# EAGLE design 608_donkey_030200 (EAGLE 9.6.2)
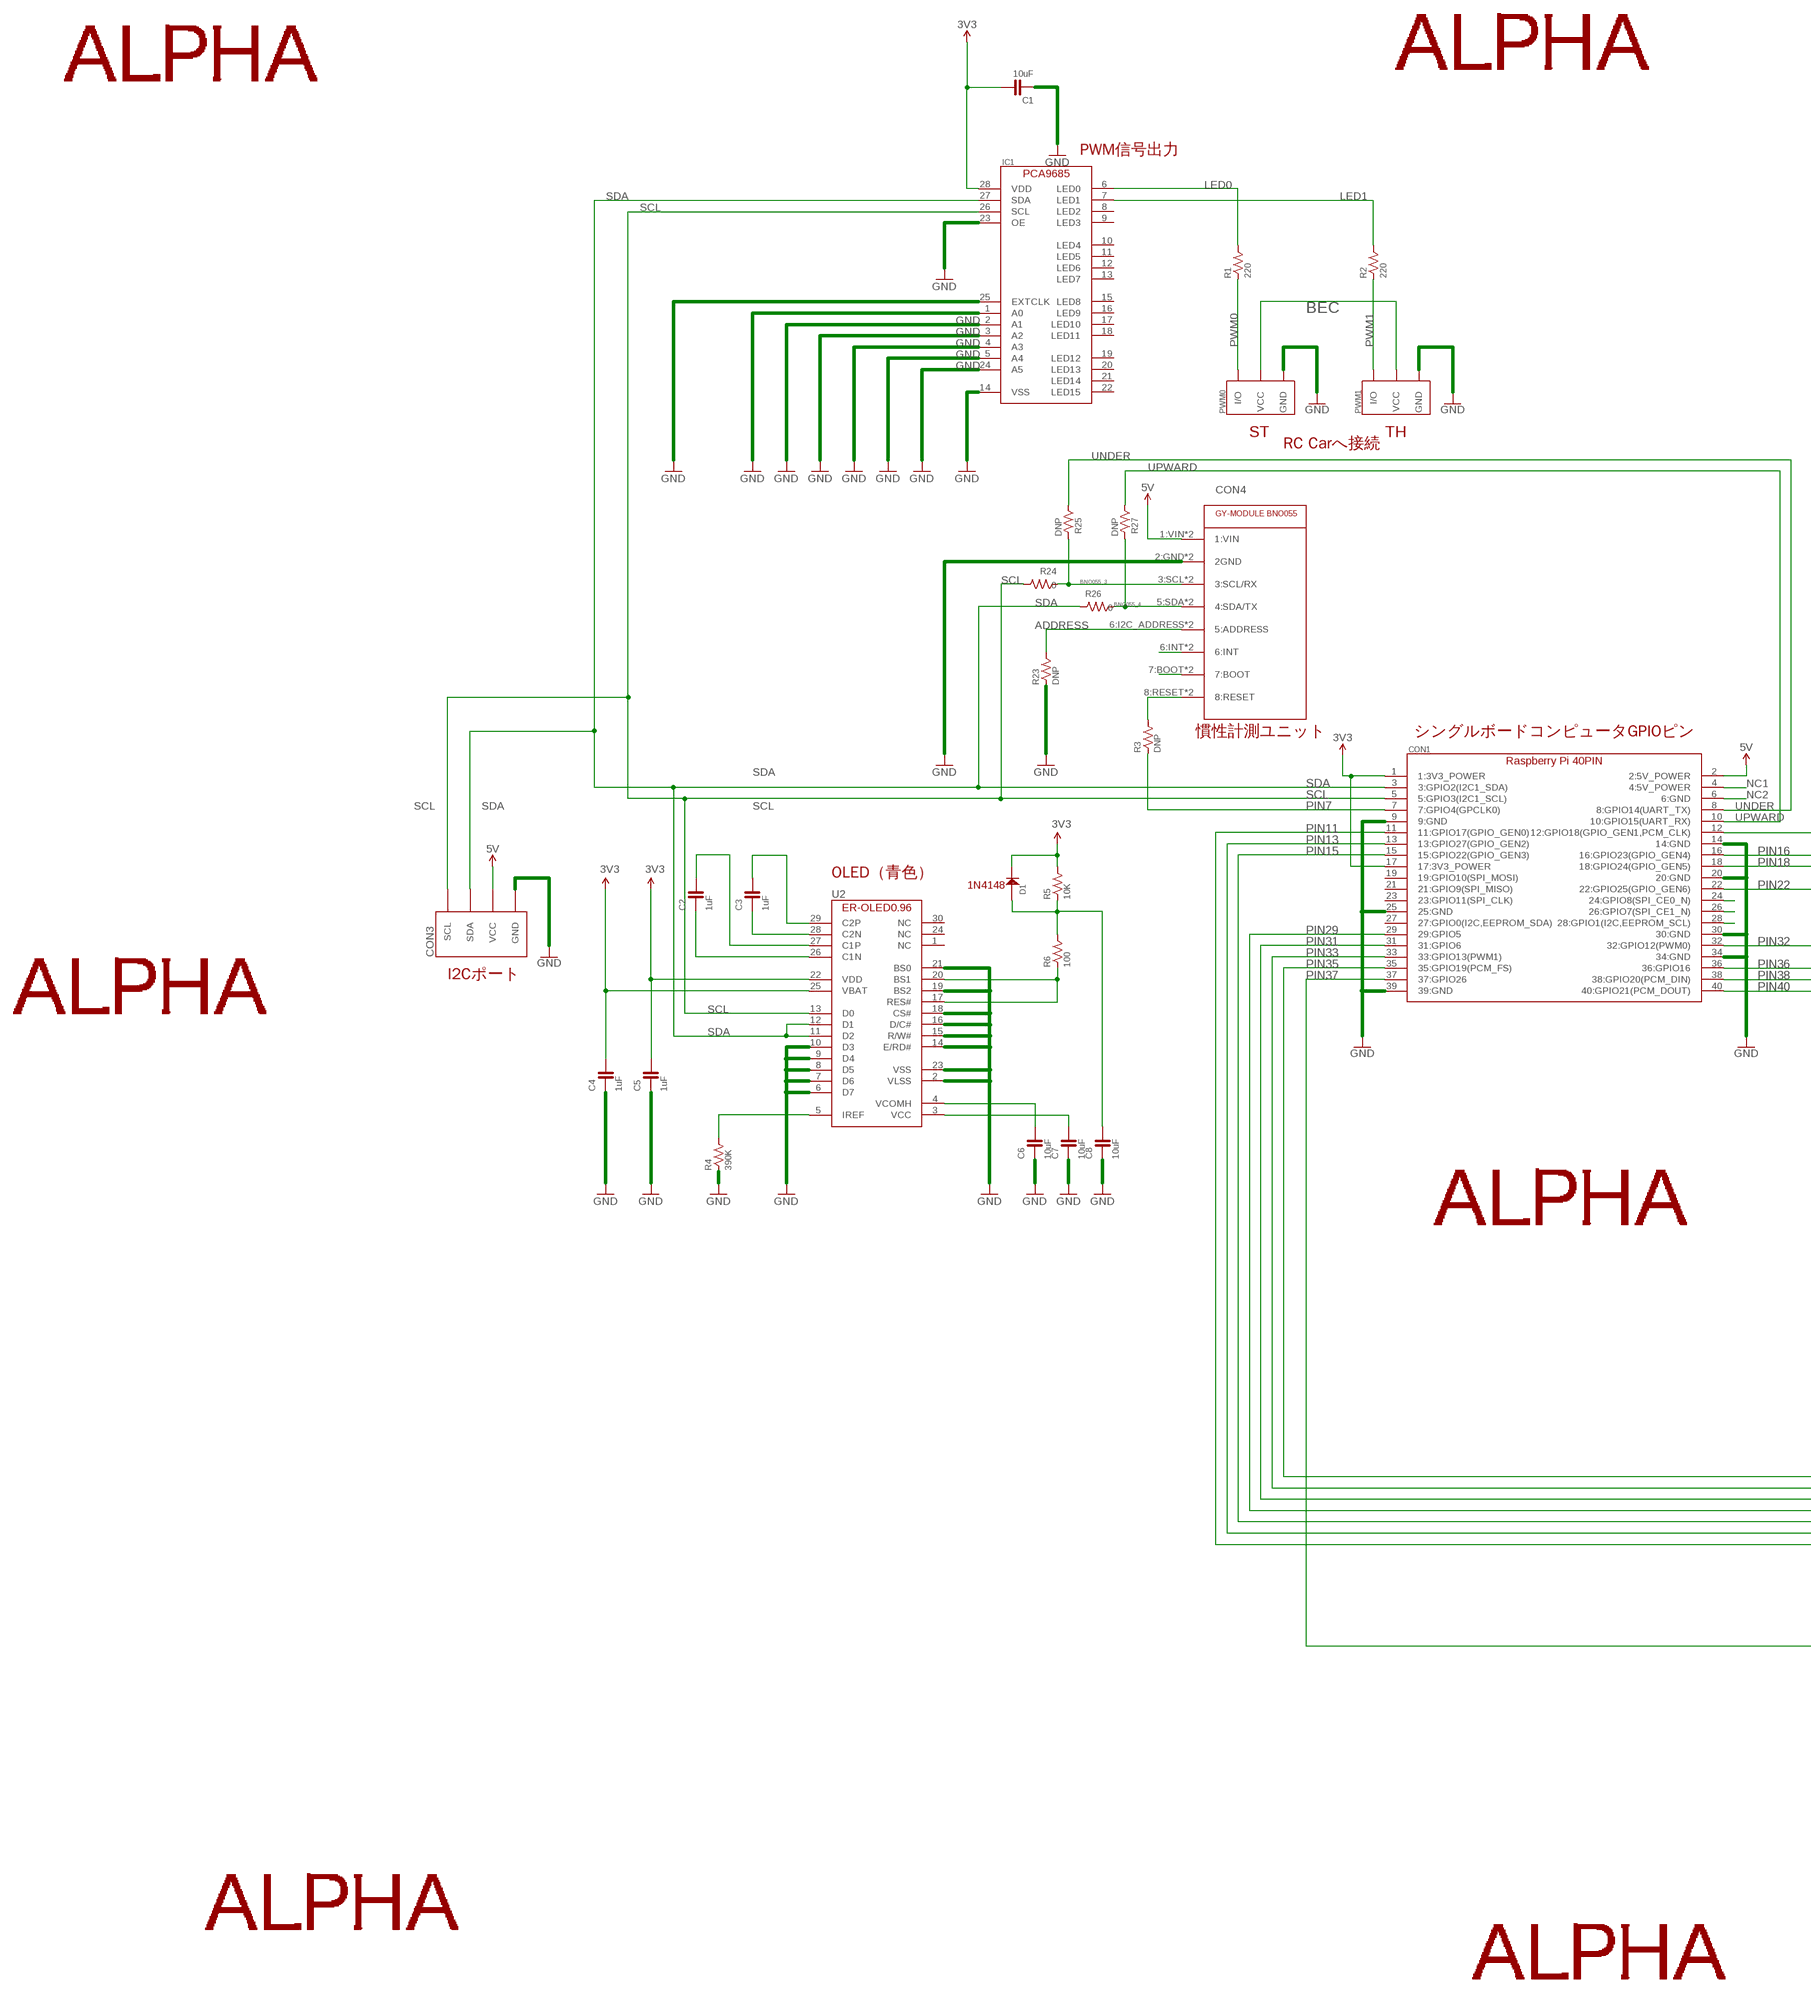
[diagram p0: schematic, sheet 1, part 1 of 3]
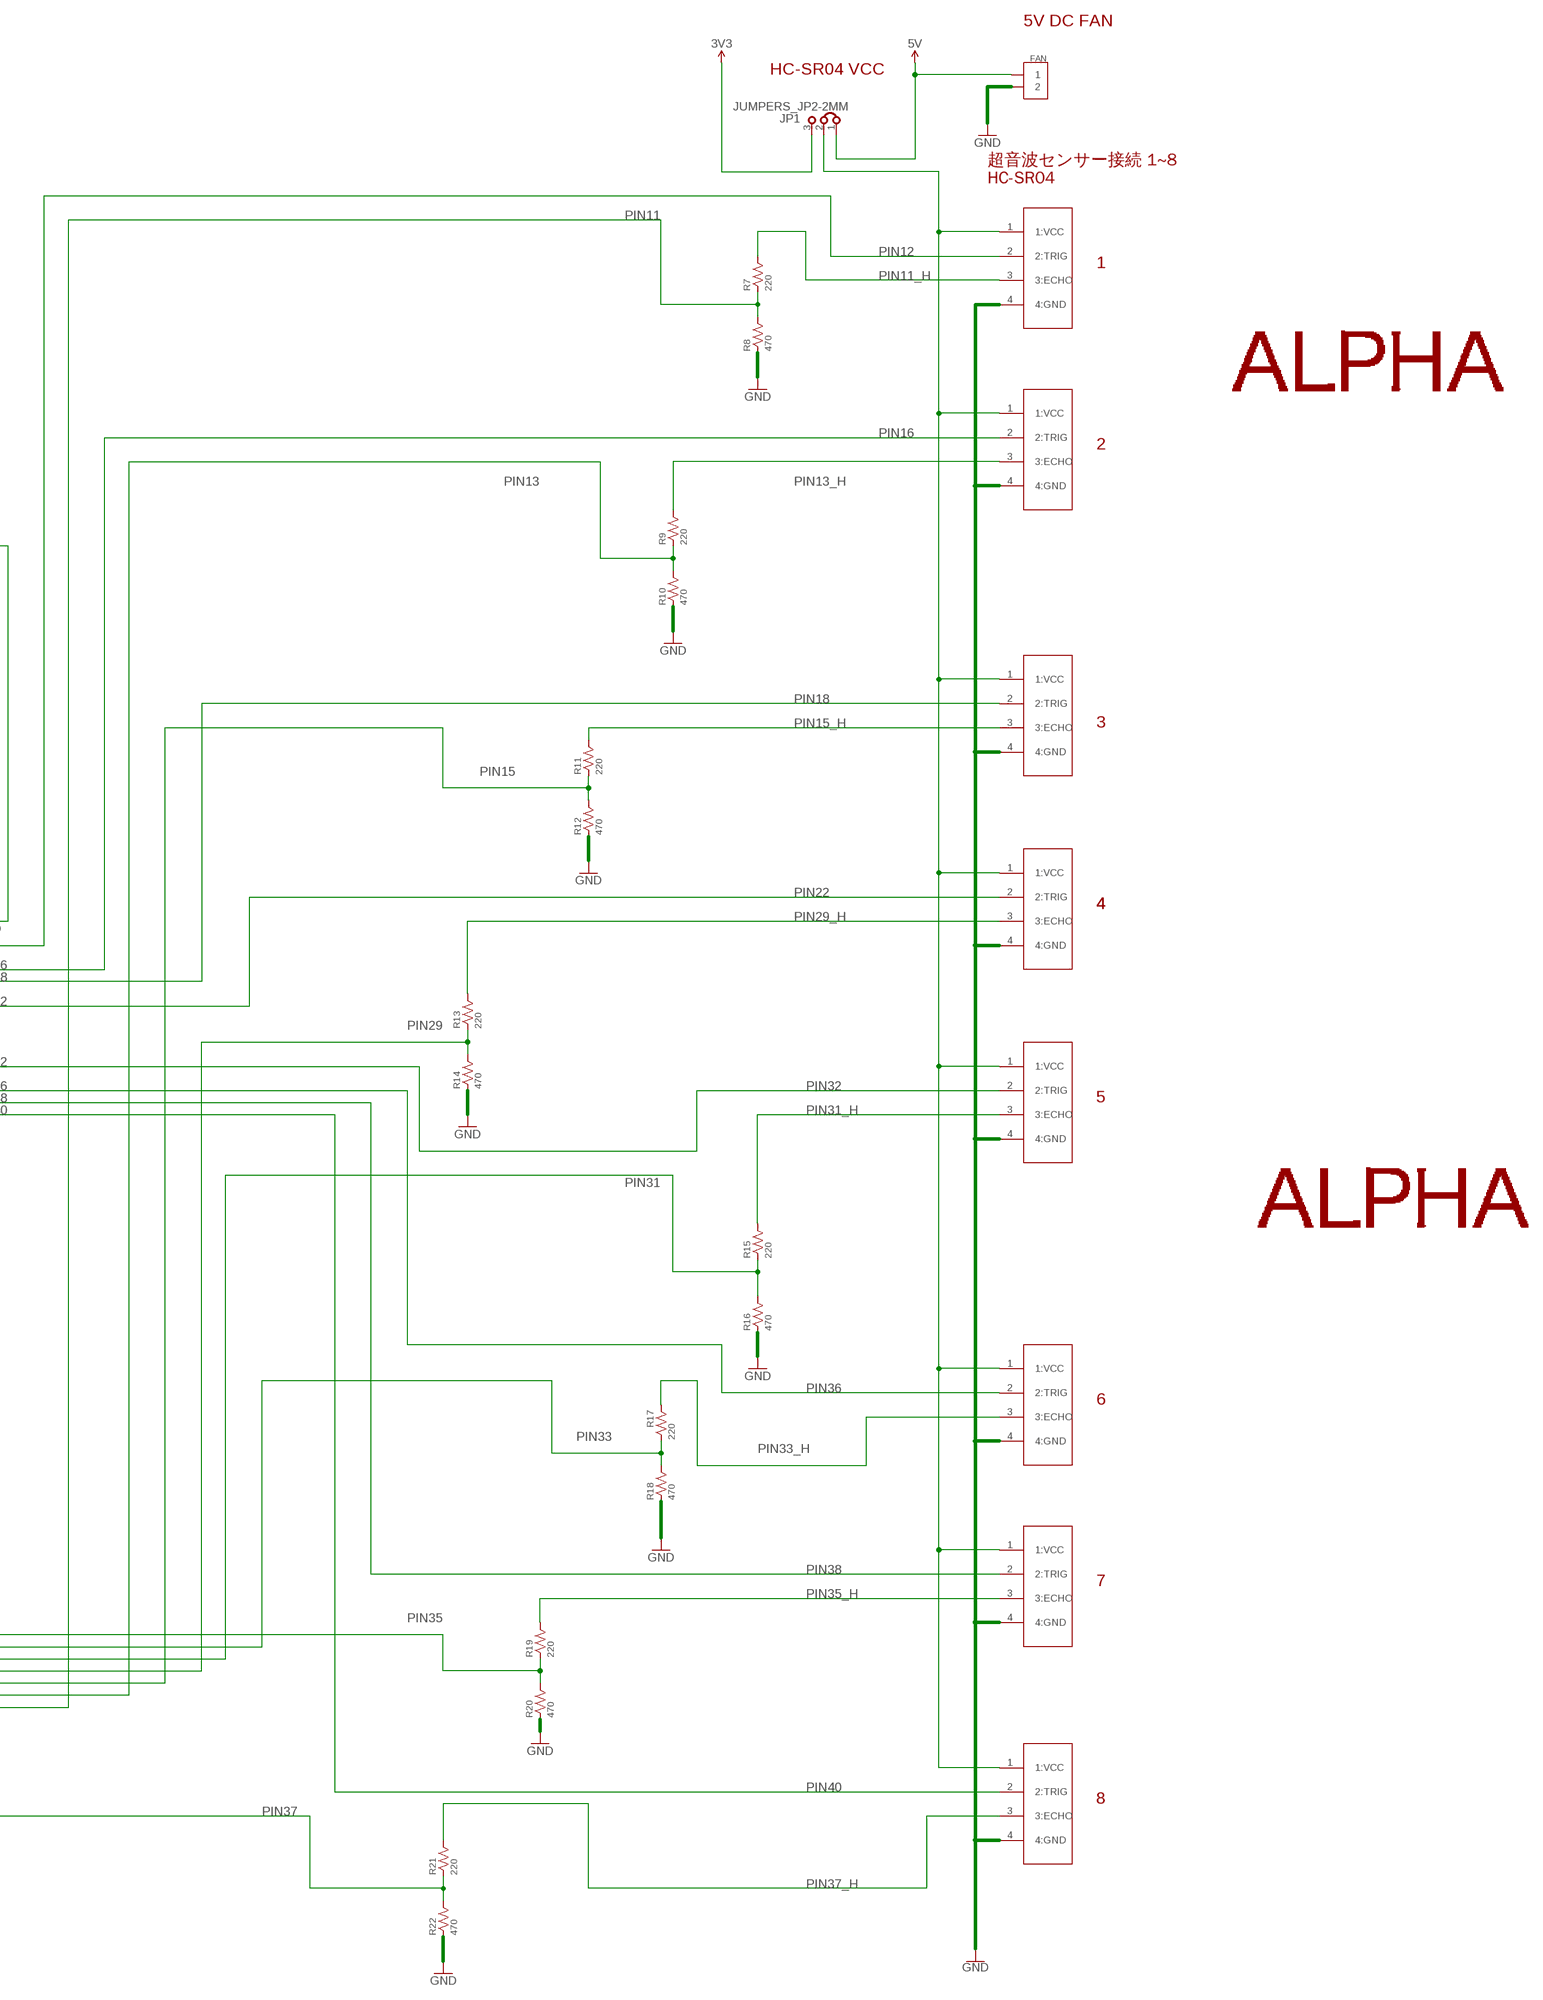
[diagram p1: schematic, sheet 1, part 2 of 3]
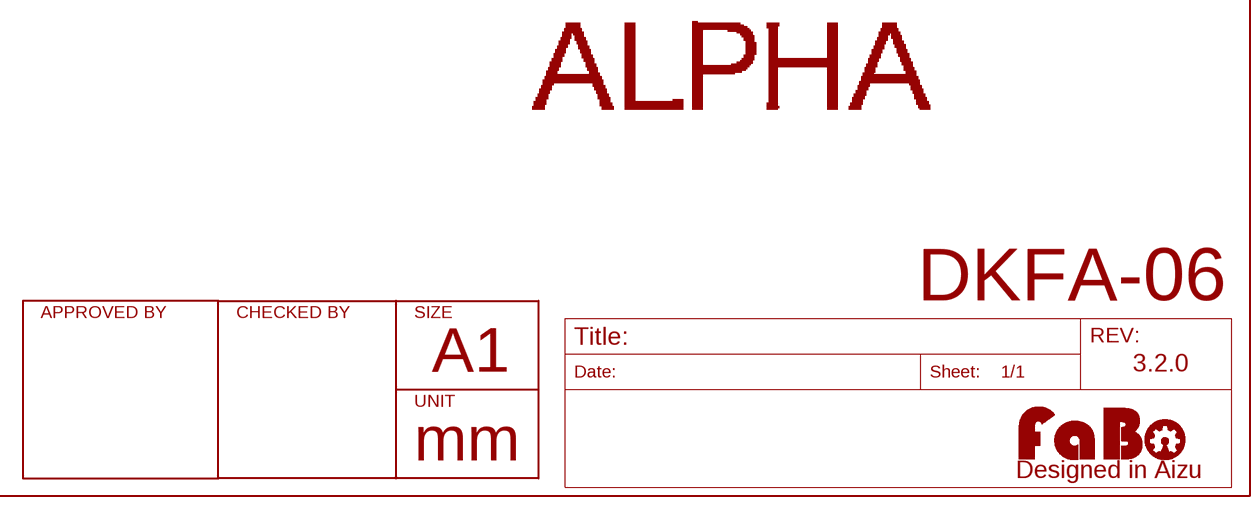
[diagram p2: schematic, sheet 1, part 3 of 3]

## Parts
C1  10uF  CAPACITOR-0603  [0603]
C2  1uF  CAPACITOR-0603-BOTTOM  [0603-BOTTOM]
C3  1uF  CAPACITOR-0603-BOTTOM  [0603-BOTTOM]
C4  1uF  CAPACITOR-0603-BOTTOM  [0603-BOTTOM]
C5  1uF  CAPACITOR-0603-BOTTOM  [0603-BOTTOM]
C6  10uF  CAPACITOR-0603-BOTTOM  [0603-BOTTOM]
C7  10uF  CAPACITOR-0603-BOTTOM  [0603-BOTTOM]
C8  10uF  CAPACITOR-0603-BOTTOM  [0603-BOTTOM]
CON1  RASPBERRYPI_SHEILD  [RASPBERRY_PI_SHILED]
CON3  FABO_BRICK_I2C-S04B-PASK-2  [FABO_BRICK_I2C_S04B-PASK-2]
CON4  GY-MODULE_BNO055  [GY-MODULE_BNO055]
D1  1N4148  [1N4148W]
FAN  PIN_1X2  [PIN_1X2]
HC1  HC-SR04CONHS-SR04CON-SPEACING  [HC-SR04CON-SPEACE]
HC2  HC-SR04CONHS-SR04CON-SPEACING  [HC-SR04CON-SPEACE]
HC3  HC-SR04CONHS-SR04CON-SPEACING  [HC-SR04CON-SPEACE]
HC4  HC-SR04CONHS-SR04CON-SPEACING  [HC-SR04CON-SPEACE]
HC5  HC-SR04CONHS-SR04CON-SPEACING  [HC-SR04CON-SPEACE]
HC6  HC-SR04CONHS-SR04CON-SPEACING  [HC-SR04CON-SPEACE]
HC7  HC-SR04CONHS-SR04CON-SPEACING  [HC-SR04CON-SPEACE]
HC8  HC-SR04CONHS-SR04CON-SPEACING  [HC-SR04CON-SPEACE]
IC1  PCA9685BS  [PCA9685]
JP1  JUMPERS_JP2-2MM  [JUMPERS_JP2-2MM]
LOGO1  LOGO_FABO-M  [LOGO_FABO_M]
PWM0  PWM0  FABO-BRICK-3PIN_HEADER  [PIN_1X3_NARROW]
PWM1  PWM1  FABO-BRICK-3PIN_HEADER  [PIN_1X3_NARROW]
R1  220  RESISTOR-0603  [0603]
R2  220  RESISTOR-0603  [0603]
R3  DNP  RESISTOR-0603-BOTTOM  [0603-BOTTOM]
R4  390K  RESISTOR-0603-BOTTOM  [0603-BOTTOM]
R5  10K  RESISTOR-0603-BOTTOM  [0603-BOTTOM]
R6  100  RESISTOR-0603-BOTTOM  [0603-BOTTOM]
R7  220  RESISTOR-0603  [0603]
R8  470  RESISTOR-0603  [0603]
R9  220  RESISTOR-0603  [0603]
R10  470  RESISTOR-0603  [0603]
R11  220  RESISTOR-0603  [0603]
R12  470  RESISTOR-0603  [0603]
R13  220  RESISTOR-0603  [0603]
R14  470  RESISTOR-0603  [0603]
R15  220  RESISTOR-0603  [0603]
R16  470  RESISTOR-0603  [0603]
R17  220  RESISTOR-0603  [0603]
R18  470  RESISTOR-0603  [0603]
R19  220  RESISTOR-0603  [0603]
R20  470  RESISTOR-0603  [0603]
R21  220  RESISTOR-0603  [0603]
R22  470  RESISTOR-0603  [0603]
R23  DNP  RESISTOR-0603-BOTTOM  [0603-BOTTOM]
R24  0  RESISTOR-0603-BOTTOM  [0603-BOTTOM]
R25  DNP  RESISTOR-0603-BOTTOM  [0603-BOTTOM]
R26  0  RESISTOR-0603-BOTTOM  [0603-BOTTOM]
R27  DNP  RESISTOR-0603-BOTTOM  [0603-BOTTOM]
U2  ER-OLED0.96-1ER-CON30HT-1_REV2  [ER-CON30HT-1_REV2]

## Nets
3V3: C1.2 C4.2 C5.2 CON1.1(1:3V3_POWER) CON1.17(17:3V3_POWER) D1.CATHODE IC1.28(VDD) JP1.3 R5.2 U2.22(VDD) U2.25(VBAT)
5V: CON1.2(2:5V_POWER) CON3.VCC CON4.1:VIN CON4.9:VIN(1:VIN) FAN.1 JP1.1
ADDRESS: CON4.6:I2C_ADDRESS(5:ADDRESS) CON4.13:ADDRESSS(5:ADDRESS) R23.2
BEC: PWM0.2(VCC) PWM1.2(VCC)
BNO055_3: CON4.3:SCL(3:SCL/RX) CON4.11:SCL(3:SCL/RX) R24.1 R25.2
BNO055_4: CON4.5:SDA(4:SDA/TX) CON4.12:SDA(4:SDA/TX) R26.1 R27.2
BOOT: CON4.7:BOOT CON4.15:BOOT(7:BOOT)
GND: C1.1 C4.1 C5.1 C6.1 C7.1 C8.1 CON1.9(9:GND) CON1.14(14:GND) CON1.20(20:GND) CON1.25(25:GND) CON1.30(30:GND) CON1.34(34:GND) CON1.39(39:GND) CON3.GND CON4.2:GND(2GND) CON4.10:GND(2GND) FAN.2 HC1.4(4:GND) HC2.4(4:GND) HC3.4(4:GND) HC4.4(4:GND) HC5.4(4:GND) HC6.4(4:GND) HC7.4(4:GND) HC8.4(4:GND) IC1.1(A0) IC1.2(A1) IC1.3(A2) IC1.4(A3) IC1.5(A4) IC1.14(VSS) IC1.23(OE) IC1.24(A5) IC1.25(EXTCLK) PWM0.3(GND) PWM1.3(GND) R4.1 R8.1 R10.1 R12.1 R14.1 R16.1 R18.1 R20.1 R22.1 R23.1 U2.2(VLSS) U2.6(D7) U2.7(D6) U2.8(D5) U2.9(D4) U2.10(D3) U2.14(E/RD#) U2.15(R/W#) U2.16(D/C#) U2.18(CS#) U2.19(BS2) U2.21(BS0) U2.23(VSS)
INT: CON4.6:INT CON4.14:INT(6:INT)
LED0: IC1.6(LED0) R1.2
LED1: IC1.7(LED1) R2.2
N$1: CON4.8:RESET CON4.16:RESET(8:RESET) R3.2
N$7: C2.1 U2.26(C1N)
N$14: C2.2 U2.27(C1P)
N$19: C3.1 U2.28(C2N)
N$21: C3.2 U2.29(C2P)
N$23: R4.2 U2.5(IREF)
N$24: C6.2 U2.4(VCOMH)
N$25: C7.2 U2.3(VCC)
N$26: R6.1 U2.17(RES#) U2.20(BS1)
N$27: C8.2 D1.ANODE R5.1 R6.2
N$63: CON1.24(24:GPIO8(SPI_CE0_N))
N$65: CON1.26(26:GPIO7(SPI_CE1_N))
N$68: CON1.28(28:GPIO1(I2C,EEPROM_SCL))
NC1: CON1.4(4:5V_POWER)
NC2: CON1.6(6:GND)
PIN7: CON1.7(7:GPIO4(GPCLK0)) R3.1
PIN11: CON1.11(11:GPIO17(GPIO_GEN0)) R7.1 R8.2
PIN11_H: HC1.3(3:ECHO) R7.2
PIN12: CON1.12(12:GPIO18(GPIO_GEN1,PCM_CLK)) HC1.2(2:TRIG)
PIN13: CON1.13(13:GPIO27(GPIO_GEN2)) R9.1 R10.2
PIN13_H: HC2.3(3:ECHO) R9.2
PIN15: CON1.15(15:GPIO22(GPIO_GEN3)) R11.1 R12.2
PIN15_H: HC3.3(3:ECHO) R11.2
PIN16: CON1.16(16:GPIO23(GPIO_GEN4)) HC2.2(2:TRIG)
PIN18: CON1.18(18:GPIO24(GPIO_GEN5)) HC3.2(2:TRIG)
PIN22: CON1.22(22:GPIO25(GPIO_GEN6)) HC4.2(2:TRIG)
PIN29: CON1.29(29:GPIO5) R13.1 R14.2
PIN29_H: HC4.3(3:ECHO) R13.2
PIN31: CON1.31(31:GPIO6) R15.1 R16.2
PIN31_H: HC5.3(3:ECHO) R15.2
PIN32: CON1.32(32:GPIO12(PWM0)) HC5.2(2:TRIG)
PIN33: CON1.33(33:GPIO13(PWM1)) R17.1 R18.2
PIN33_H: HC6.3(3:ECHO) R17.2
PIN35: CON1.35(35:GPIO19(PCM_FS)) R19.1 R20.2
PIN35_H: HC7.3(3:ECHO) R19.2
PIN36: CON1.36(36:GPIO16) HC6.2(2:TRIG)
PIN37: CON1.37(37:GPIO26) R21.1 R22.2
PIN37_H: HC8.3(3:ECHO) R21.2
PIN38: CON1.38(38:GPIO20(PCM_DIN)) HC7.2(2:TRIG)
PIN40: CON1.40(40:GPIO21(PCM_DOUT)) HC8.2(2:TRIG)
PWM0: PWM0.1(I/O) R1.1
PWM1: PWM1.1(I/O) R2.1
SCL: CON1.5(5:GPIO3(I2C1_SCL)) CON3.SCL IC1.26(SCL) R24.2 U2.13(D0)
SDA: CON1.3(3:GPIO2(I2C1_SDA)) CON3.SDA IC1.27(SDA) R26.2 U2.11(D2) U2.12(D1)
TR_VCC: HC1.1(1:VCC) HC2.1(1:VCC) HC3.1(1:VCC) HC4.1(1:VCC) HC5.1(1:VCC) HC6.1(1:VCC) HC7.1(1:VCC) HC8.1(1:VCC) JP1.2
UNDER: CON1.8(8:GPIO14(UART_TX)) R25.1
UPWARD: CON1.10(10:GPIO15(UART_RX)) R27.1
Unconnected: CON1.19(19:GPIO10(SPI_MOSI)) CON1.21(21:GPIO9(SPI_MISO)) CON1.23(23:GPIO11(SPI_CLK)) CON1.27(27:GPIO0(I2C,EEPROM_SDA)) IC1.8(LED2) IC1.9(LED3) IC1.10(LED4) IC1.11(LED5) IC1.12(LED6) IC1.13(LED7) IC1.15(LED8) IC1.16(LED9) IC1.17(LED10) IC1.18(LED11) IC1.19(LED12) IC1.20(LED13) IC1.21(LED14) IC1.22(LED15) U2.1(NC) U2.24(NC) U2.30(NC)

## Notes on the sheet
- 5V DC FAN
- HC-SR04 VCC
- 超音波センサー接続 1~8
  HC-SR04
- PWM信号出力
- 1
- 2
- ST | TH
- RC Carへ接続
- CON4
- 3
- 慣性計測ユニット | シングルボードコンピュータGPIOピン
- 4 | 4
- OLED（青色）
- 1N4148
- I2Cポート | 5
- 6
- 7
- 8
- DKFA-06
- 3.2.0

## Library data of the parts
C1-C8 = FaBo-Capacitor:CAPACITOR: CAPACITOR
CON1 = FaBo-Boards:RASPBERRYPI_SHEILD
CON3 = FaBo-Template:FABO_BRICK_I2C: FaBo Brick I2C
CON4 = FaBo-ModulePin:GY-MODULE_BNO055
D1 = FaBo-Diode:1N4148
FAN = FaBo-PIN:PIN_1X2
HC1-HC8 = FaBo-Connetor:HC-SR04CON
IC1 = FaBo-Motor:PCA9685BS
JP1 = 52101-101-REV-A_v16:JUMPERS_JP2-: Jumper/Bridge
LOGO1 = component:LOGO_FABO
PWM0 PWM1 = component:FABO-BRICK-3PIN
R1-R27 = FaBo-Resistors:RESISTOR: RESISTOR
U2 = FaBo-Display:ER-OLED0.96-1: ER-CON30HT-1 Rev2 wide distance 0.23mm

## Board
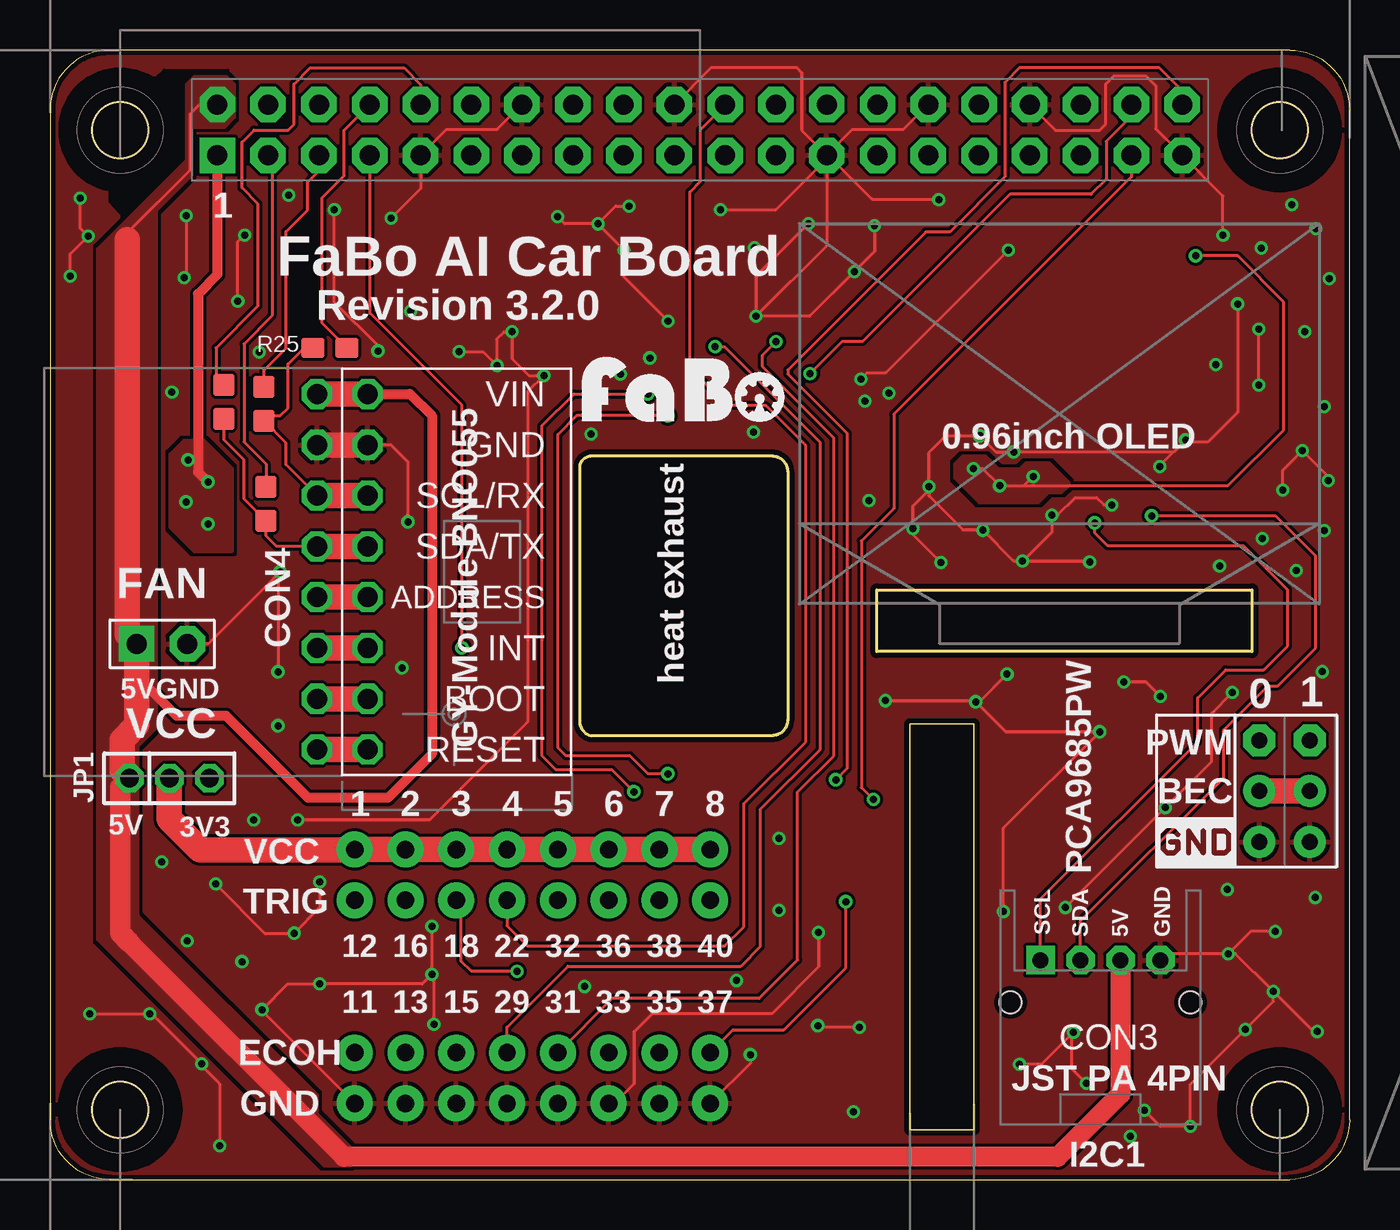
[diagram p3: board, top side]
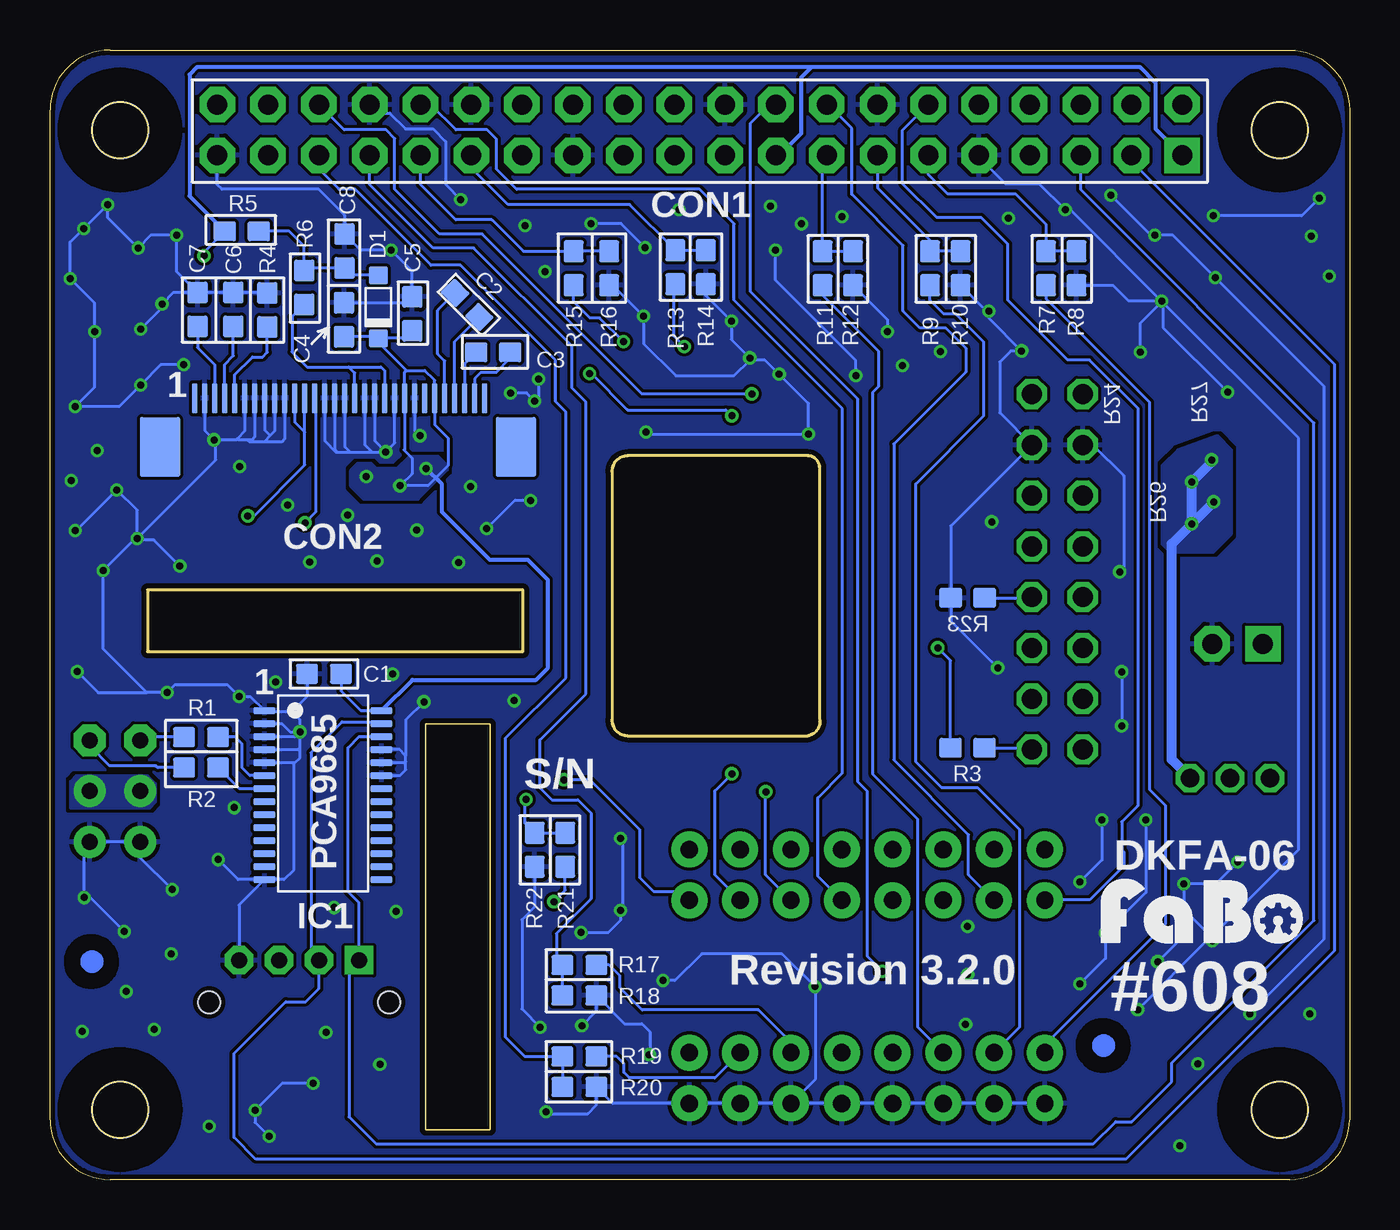
[diagram p4: board, bottom side, seen from below]

Size 65 x 56.5 mm. Coordinates in mm from the lower left corner, seen from the top.
Outline: 41.35,29.5 60.12,29.5 60.12,26.41 41.35,26.41 41.35,29.5
Outline: 43,22.8 46.2,22.8 46.2,2.5 43,2.5 43,22.8
Outline: 27.1,36.2 36.1,36.2 arc-90 36.9,35.4 36.9,23 arc-90 36.1,22.2 27.1,22.2 arc-90 26.5,23 26.5,35.6 arc-90 27.1,36.2
Copper layers (1*16): Top 0.035mm / dielectric 1.6mm / Bottom 0.035mm
Design rules "PCBway": minimum track width 6mil, minimum drill 12mil, track to track 6mil, track to pad 6mil, pad to pad 6mil, via to via 6mil, smd to smd 6mil, copper to edge 10mil, drill to drill 10mil, minimum pad ring 10mil, minimum via ring 6mil, stop-mask expansion 2mil, vias tented up to drill 100mil, thermal gap 8mil
Holes 2.8 mm at 3.5,52.5 61.5,52.5 3.5,3.5 61.5,3.5
tRestrict: area 0.5,49.4 to 6.6,55.6; area 58.4,49.4 to 64.6,55.6; area 0.4,0.4 to 6.6,6.6; area 58.4,0.4 to 64.6,6.6; 4 lines
bRestrict: area 0.4,49.4 to 6.6,55.6; area 58.4,49.4 to 64.6,55.6; area 0.4,0.4 to 6.6,6.6; area 58.4,0.4 to 64.6,6.6; 14 lines

### Footprints (pad centres in the part's own frame; a part is rotated, then mirrored left to right if it is on the bottom)
0603 = smd 1.1 x 1: 1 -0.85,0; 2 0.85,0
0603-BOTTOM = smd 1.1 x 1 bottom: 1 -0.85,0; 2 0.85,0
RASPBERRY_PI_SHILED = drill 1 pad 1.778 square: 1 -24.13,-1.27 | drill 1 pad 1.778 octagon: 2 -24.13,1.27; 3 -21.59,-1.27; 4 -21.59,1.27; 5 -19.05,-1.27; 6 -19.05,1.27; 7 -16.51,-1.27; 8 -16.51,1.27; 9 -13.97,-1.27; 10 -13.97,1.27; 11 -11.43,-1.27; 12 -11.43,1.27; 13 -8.89,-1.27; 14 -8.89,1.27; 15 -6.35,-1.27; 16 -6.35,1.27; 17 -3.81,-1.27; 18 -3.81,1.27; 19 -1.27,-1.27; 20 -1.27,1.27; 21 1.27,-1.27; 22 1.27,1.27; 23 3.81,-1.27; 24 3.81,1.27; 25 6.35,-1.27; 26 6.35,1.27; 27 8.89,-1.27; 28 8.89,1.27; 29 11.43,-1.27; 30 11.43,1.27; 31 13.97,-1.27; 32 13.97,1.27; 33 16.51,-1.27; 34 16.51,1.27; 35 19.05,-1.27; 36 19.05,1.27; 37 21.59,-1.27; 38 21.59,1.27; 39 24.13,-1.27; 40 24.13,1.27
FABO_BRICK_I2C_S04B-PASK-2 = drill 0.8 pad 1.422 octagon: GND -3,0; SDA 1,0; VCC -1,0 | drill 0.8 pad 1.422 square: SCL 3,0 | hole 1.1: 4.5,2.1; -4.5,2.1
GY-MODULE_BNO055 = drill 1 pad 1.5 octagon: 1:VIN 8.89,3.81; 2:GND 6.35,3.81; 3:SCL 3.81,3.81; 5:SDA 1.27,3.81; 6:I2C_ADDRESS -1.27,3.81; 6:INT -3.81,3.81; 7:BOOT -6.35,3.81; 8:RESET -8.89,3.81; 9:VIN 8.89,6.35; 10:GND 6.35,6.35; 11:SCL 3.81,6.35; 12:SDA 1.27,6.35; 13:ADDRESSS -1.27,6.35; 14:INT -3.81,6.35; 15:BOOT -6.35,6.35; 16:RESET -8.89,6.35
1N4148W = smd 0.9 x 0.95: ANODE 0,0; CATHODE 3.15,0
PIN_1X2 = drill 1 pad 1.778 square: 1 -1.27,0 | drill 1 pad 1.778 octagon: 2 1.27,0
HC-SR04CON-SPEACE = drill 0.87 pad 1.8: 1 -6.35,0; 2 -3.81,0; 3 3.81,0; 4 6.35,0
PCA9685 = smd 0.3 x 1.1: 1 -4.15,-2.93; 2 -3.5,-2.93; 3 -2.85,-2.93; 4 -2.2,-2.93; 5 -1.55,-2.93; 6 -0.9,-2.93; 7 -0.25,-2.93; 8 0.4,-2.93; 9 1.05,-2.93; 10 1.7,-2.93; 11 2.35,-2.93; 12 3,-2.93; 13 3.65,-2.93; 14 4.3,-2.93; 15 4.3,2.92; 16 3.65,2.92; 17 3,2.92; 18 2.35,2.92; 19 1.7,2.92; 20 1.05,2.92; 21 0.4,2.92; 22 -0.25,2.92; 23 -0.9,2.92; 24 -1.55,2.92; 25 -2.2,2.92; 26 -2.85,2.92; 27 -3.5,2.92; 28 -4.15,2.92
JUMPERS_JP2-2MM = drill 0.914 octagon: 1 -2,0; 2 0,0; 3 2,0
PIN_1X3_NARROW = drill 0.8 pad 1.6 octagon: 1 -2.54,0 | drill 0.8 pad 1.6: 2 0,0; 3 2.54,0
ER-CON30HT-1_REV2 = smd 0.27 x 1.5 bottom: 1 7,-0.23; 2 6.5,-0.23; 3 6,-0.23; 4 5.5,-0.23; 5 5,-0.23; 6 4.5,-0.23; 7 4,-0.23; 8 3.5,-0.23; 9 3,-0.23; 10 2.5,-0.23; 11 2,-0.23; 12 1.5,-0.23; 13 1,-0.23; 14 0.5,-0.23; 15 0,-0.23; 16 -0.5,-0.23; 17 -1,-0.23; 18 -1.5,-0.23; 19 -2,-0.23; 20 -2.5,-0.23; 21 -3,-0.23; 22 -3.5,-0.23; 23 -4,-0.23; 24 -4.5,-0.23; 25 -5,-0.23; 26 -5.5,-0.23; 27 -6,-0.23; 28 -6.5,-0.23; 29 -7,-0.23; 30 -7.5,-0.23 | smd 2 x 3 bottom: 31 -9.07,-2.67; 32 8.74,-2.67

### Placement (x,y rotation side)
C1  51.29,25.29 0 bottom
C2  44.14,43.75 225 top
C3  42.83,41.38 180 top
C4  50.29,43.01 270 top
C5  46.88,43.31 270 top
C6  55.83,43.52 270 top
C7  57.62,43.52 270 top
C8  50.27,46.44 270 top
CON1  32.5,52.5 0 top
CON3  52.55,10.97 180 top
CON4  19.7,30.4 90 top
D1  48.58,45.23 270 bottom
FAN  5.6,26.8 0 top
HC1  15.24,10.16 270 top
HC2  17.78,10.16 270 top
HC3  20.32,10.16 270 top
HC4  22.86,10.16 270 top
HC5  25.4,10.16 270 top
HC6  27.94,10.16 270 top
HC7  30.48,10.16 270 top
HC8  33.02,10.16 270 top
IC1  51.34,19.3 270 bottom
JP1  5.97,20.07 0 top
LOGO1  7.38,11.43 0 bottom
LOGO2  [LOGO_FABO_M]  31.68,37.53 0 top
PWM0  60.48,19.43 270 top
PWM1  63.02,19.43 270 top
R1  57.44,22.13 0 bottom
R2  57.44,20.61 0 bottom
R3  19.11,21.59 180 top
R4  54.13,43.49 270 top
R5  55.41,47.43 0 top
R6  52.29,44.62 90 top
R7  15.18,45.58 270 bottom
R8  13.66,45.58 90 bottom
R9  20.98,45.58 270 bottom
R10  19.46,45.58 90 bottom
R11  26.36,45.58 270 bottom
R12  24.83,45.58 90 bottom
R13  33.72,45.64 270 bottom
R14  32.2,45.64 90 bottom
R15  38.8,45.58 270 bottom
R16  37.03,45.58 90 bottom
R17  38.52,10.73 0 bottom
R18  38.52,9.2 180 bottom
R19  38.52,6.15 0 bottom
R20  38.52,4.63 180 bottom
R21  39.23,16.49 270 bottom
R22  40.75,16.49 90 bottom
R23  19.1,29.1 180 top
R24  10.7,38.8 90 bottom
R25  14,41.6 0 bottom
R26  10.8,33.8 90 bottom
R27  8.7,38.9 270 bottom
U2  50.76,39.31 0 top
U$1  [MARK_POINT_3MM]  12.3,6.7 0 bottom
U$2  [MARK_POINT_3MM]  62.9,10.9 0 bottom
U$3  [LOGO_SILK_GND]  55.4,15.62 0 top

### Tracks (layer width: path | path; a pad name or v marks a point on that pad's centre or on a via)
3V3  (via drill 0.35)
  Top 0.152: 48.72,34.7 v47.5,34.7 46.64,35.56 v46.18,35.56 | 48.72,34.7 58.9,34.7 61.7,37.5 61.7,43.9 59.4,46.2 v57.3,46.2 | v49.18,35.16 48.72,34.7
  Top 0.508: CON1.1 8.37,45.27 7.4,44.3 7.4,35.4 v7.9,34.9
  Bottom 0.152: v57.3,46.2 57.3,46.39 R5.2 | D1.CATHODE 48.58,41.88 47.17,40.47 | 47.17,40.47 46.25,40.47 45.76,39.98 U2.25 45.76,37.76 45.1,37.1 45.1,35.7 46.1,34.7 v47.5,34.7 46.9,35.3 46.9,36.1 47.3,36.5 47.26,36.54 U2.22 47.26,40.38 47.17,40.47 | C5.2 47.26,42.08 D1.CATHODE | D1.CATHODE 48.66,42.16 C4.2 | C1.2 50.44,24.44 49.45,23.45 IC1.28
  Bottom 0.203: CON1.1 9.7,52.56 9.7,54.86 10.47,55.63 26.92,55.63 | 26.92,55.63 27.43,55.12 27.43,52.32 28.53,51.23 CON1.17 | 26.92,55.63 57.66,55.63 58.02,55.26 58.02,49.2 R5.2 | IC1.28 46.87,25 40.7,25 40.1,25.6 40.1,30 41.1,31 43,31 45.4,33.4 45.4,34.78 v46.18,35.56
  Bottom 0.508: JP1.3 8.9,21 8.9,31.8 v7.9,32.8 | v7.9,32.8 v6.8,33.9 | v7.9,32.8 v7.9,34.9 6.9,35.9 v6.9,36
  pour Bottom (no thermals): 45.52,35.1 45.11,35.51 45.11,35.56 45.11,35.71 45.52,36.12 45.57,36.17 46.79,36.17 47.04,36.17 47.65,35.56 48.67,35.56 48.92,35.81 49.63,35.81 49.73,35.71 49.99,35.46 49.99,34.7 49.33,34.04 46.89,34.04 46.58,34.04
  pour Top (no thermals): 45.26,35.05 45.26,35.81 45.67,36.22 46.79,36.22 47.04,35.97 47.45,35.56 48.26,35.56 48.51,35.56 48.82,35.86 49.99,35.86 50.29,35.56 50.95,34.9 50.95,34.7 50.6,34.34 49.94,34.34 49.43,33.83 46.74,33.83 46.48,33.83
  pour Bottom (no thermals): 5.9,32.3 5.9,36.5 6.6,37.2 8.6,36.5 9.4,35.7 9.4,31.8 9,31.4 6.8,31.4
  pour Top (no thermals): 6,32.6 6,36.3 6.7,37 7.7,37 9.1,35.6 9.1,31.4 7.2,31.4
5V
  Top 0.152: 3.87,47.01 3.87,47.37 7,50.5 7,53.3 7.47,53.77 CON1.2
  Top 0.508: CON4.1:VIN 18.01,39.29 19.1,38.2 19.1,21.3 16.9,19.1 12.9,19.1 8.8,23.2 6.33,23.2 4.33,25.2
  Top 1: CON3.VCC 53.55,4.27 50.41,1.13 14.71,1.13 3.97,11.87
  Top 1.016: 3.97,11.87 3.5,12.34 3.5,19.6 JP1.1
  Top 1.27: 3.87,47.01 3.87,27.26 FAN.1 4.33,25.2 4.33,22.73 3.6,22 3.6,20.45 JP1.1 | CON4.9:VIN CON4.1:VIN
  pour Top (no thermals): 6.8,50.98 2.36,46.54 2.36,12.01 13.69,0.68 15.03,0.68 15.03,1.63 13.38,3.28 13.38,4.24 4.42,13.2 4.42,21.67 5.33,22.58 5.33,48.46 7.12,50.25 7.12,52.65 8.76,52.65 9.24,53.13 9.24,54.78 8.85,55.17 7.19,55.17 6.8,54.78
ADDRESS
  Top 1.27: CON4.13:ADDRESSS CON4.6:I2C_ADDRESS
  Bottom 0.152: R23.2 15.92,29.1 CON4.6:I2C_ADDRESS
BEC
  Top 1.27: PWM0.2 PWM1.2
  pour Bottom (no thermals): 59.7,18.9 59.7,19.8 60.1,20.2 63.7,20.2 64,19.9 64,18.6 60,18.6
BNO055_3
  Top 0.152: CON4.11:SCL 11.8,35.76 11.8,36.85 R24.1 10.95,38.2 11.5,38.2 11.9,38.6 11.9,40.8 12.7,41.6 R25.2
  Top 1.27: CON4.11:SCL CON4.3:SCL
BNO055_4
  Top 0.152: CON4.12:SDA 11.33,31.67 10.8,32.2 R26.1 9.7,34.05 9.7,36 8.7,37 R27.2
  Top 1.27: CON4.12:SDA CON4.5:SDA
BOOT
  Top 1.27: CON4.15:BOOT CON4.7:BOOT
GND  (via drill 0.35)
  Top 0.152: v16.4,41.45 16.4,41.7 14.22,43.88 v14.22,48.51 | CON1.14 22.37,52.53 19.83,52.53 CON1.9 18.53,49.55 v17.06,48.08 | CON1.25 38.9,51.27 | 38.9,51.27 40.15,52.53 42.69,52.53 CON1.30 | CON1.25 38.85,51.05 | 38.85,51.05 38.85,46.72 v35.31,43.18 | v33.53,48.51 36.31,48.51 38.85,51.05 | CON1.20 33.09,55.63 37.34,55.63 37.59,55.37 37.59,52.49 CON1.25 | v58.67,47.24 58.67,49.2 56.64,51.23 CON1.39 55.3,52.56 55.3,54.7 54.8,55.2 53.2,55.2 52.8,54.8 52.8,52.8 52.5,52.5 50.28,52.5 CON1.34 | v44.45,49.02 41.15,49.02 38.9,51.27 | 56.19,36.4 56.2,36.4 v56.8,37 56.9,36.9 57.9,36.9 59.4,38.4 v59.4,43.8 | 56.19,36.4 v48.2,36.4 47.3,36.4 v46.5,37.2 44.8,37.2 43.96,36.36 v43.96,34.66 43.96,34.49 | v30.92,42.93 28.71,45.14 v28.71,46.48 27.41,47.78 v27.41,47.8 | v23.11,42.42 23.11,42.4 | 23.11,42.4 23.11,41.06 23.95,40.22 v24.7,40.22 23.89,39.41 23.89,22.89 18.98,17.98 v12.38,17.98 | v47.93,46.48 41.79,40.34 40.86,40.34 v40.56,40.04 | v6.82,48.21 6.82,45.21 v6.72,45.11 | v9.4,43.94 9.4,46.91 v9.73,47.24 | v8.28,14.78 10.74,12.32 v12.2,12.32 | v12.2,12.32 v12.21,12.32 | v1.98,8.28 v4.98,8.28 5.08,8.28 v7.58,5.78 7.58,5.68 8.48,4.78 v8.48,1.68 | v19.2,7.76 19.2,10.16 v19.1,10.26 | v19.1,10.26 v19.1,12.66 | v19.1,10.26 18.62,9.78 v13.48,9.78 11.88,9.78 v10.6,8.5 10.6,8.45 HC1.4 | v35.03,6.25 35.03,5.82 HC8.4 | v38.45,12.35 38.45,10.65 36.1,8.3 30.1,8.3 29.2,7.4 29.2,4.8 28.21,3.81 HC6.4 | v51.2,7.36 51.12,7.28 | 51.12,7.28 49.6,5.75 v48.5,5.75 | v51.83,4.82 51.12,5.53 51.12,7.28 | v54.74,3.46 55.54,2.66 v57.04,2.66 57.04,4.75 v59.79,7.5 61.19,8.9 v61.19,9.4 | v61.19,9.4 63.19,7.4 v63.39,7.4
  Top 0.152: v61.29,12.4 60.05,12.4 v58.95,11.29 | v58.95,11.29 55.87,11.29 CON3.GND | 43.96,34.49 43.96,34.2 45.69,32.48 v46.65,32.48 48.19,30.94 v48.65,30.94 48.67,30.94 | v60.47,39.74 v60.47,42.53 | v41.23,47.71 41.23,46.41 v40.23,45.41 37.99,43.18 v35.31,43.18 | v37.93,47.81 35.31,45.19 v35.31,43.18 | v27.41,47.8 28.3,48.69 v28.96,48.69 | v27.41,47.8 25.75,47.8 v25.39,48.16 | v20.46,41.41 21.66,41.41 v22.36,40.71 22.36,42.06 22.7,42.4 23.11,42.4 | v40.49,7.62 38.48,7.62 v38.4,7.7 | v13.48,14.88 13.48,13.6 v12.2,12.32 | v1.01,45.19 1.01,46.29 v1.91,47.19 1.51,47.59 v1.51,49.09 | v46.3,23.9 47.8,22.4 v52.5,22.4 47.69,17.59 v47.69,13.4 | 43.96,34.49 43.16,33.7 v43.16,32.56 43.16,32.27 v44.56,30.86 | 48.67,30.94 51.95,30.94 v52,30.89 | 48.67,30.94 50.12,32.39 v50.12,33.23 50.4,33.23 51.26,34.09 52.38,34.09 52.73,33.73 v53.12,33.73 | v55.54,24.16 54.82,24.88 v53.71,24.88 | v55.51,35.66 55.51,35.72 56.19,36.4 | v41.79,23.95 46.25,23.95 v46.3,23.9 | v46.3,23.9 46.5,23.9 v47.87,25.28 | v59.14,24.36 58.1,23.32 58.1,20.91 v55.79,18.6 v50.79,13.6 | v61.65,34.49 61.65,35.48 v62.64,36.46 63.94,35.16 v63.94,34.96 | v61.19,9.4 59.3,11.29 v58.95,11.29 | FAN.2 7.9,26.8 v11.5,30.4 11.4,30.3 v11.4,25.4 | v17.9,32.9 17.9,35.9 17.05,36.75 CON4.2:GND
  Top 1.27: CON4.10:GND CON4.2:GND
  Bottom 0.152: HC1.4 HC2.4 HC3.4 HC4.4 HC5.4 HC6.4 | HC6.4 HC7.4 HC8.4 36.85,3.81 R20.1 37.67,3.73 38.1,3.3 40.1,3.3 v40.18,3.38 | R4.1 54.15,44.37 C6.1 C7.1 | CON1.39 56.63,49.77 56.39,49.53 51.56,49.53 50.27,48.24 C8.1 49.46,46.48 v47.93,46.48 46.88,45.43 C5.1 47.17,43.86 C4.1 | C7.1 58.67,45.42 v58.67,47.24 59.95,47.24 v60.6,46.6 62.12,48.12 v62.12,48.76 v63.32,47.56 63.99,46.89 v63.99,45.06 62.77,43.84 v62.77,42.42 62.77,39.63 v63.74,38.66 61.55,38.66 v60.47,39.74 59.45,40.76 v58.31,40.76 | CON1.34 48.58,53.34 48.01,53.34 47.22,52.55 45.85,52.55 45.21,51.92 45.21,49.78 v44.45,49.02 | 6.86,12.1 v6.86,11.94 7.16,11.94 v10.6,8.5 | 6.86,12.1 6.86,12.19 2.54,16.51 2.54,37.08 9.33,43.87 | 9.33,43.87 v9.4,43.94 | v46.5,37.2 46.76,37.46 U2.23 | v48.2,36.4 48.76,36.96 U2.19 | 48.9,36.4 v48.2,36.4 | 48.9,36.4 49.26,36.76 U2.18 | 50,36.4 50.26,36.66 U2.16 | 50,36.4 48.9,36.4 | 50.63,36.4 50.7,36.4 51.26,36.96 U2.14 | 50.63,36.4 50,36.4 | 56.7,37 55.7,37 55.65,37.05 | 56.7,37 v56.8,37 57.26,37.46 U2.2 | 55.1,37 54.9,37 54.76,37.14 U2.7 | 55.1,37 55.6,37 55.65,37.05 | 54.3,36.9 55,36.9 55.1,37 | 54.3,36.9 53.4,36.9 53.26,37.04 U2.10 | C7.1 58.83,44.37 v59.4,43.8 59.4,43.6 v60.47,42.53 | v24.7,40.22 24.7,40.97 28.71,44.98 v28.71,46.48 | v9.4,43.94 9.43,43.97 | 9.43,43.97 13.97,48.51 v14.22,48.51 15.51,49.8 17.2,49.8 18.53,51.13 CON1.9 | R8.1 11.83,44.73 11.07,43.97 9.43,43.97 | R10.1 18.16,43.43 v18.03,43.43 18.03,43.08 v16.4,41.45 16.95,41.45 17.5,40.9 17.5,38.36 CON4.2:GND 19.95,32.69 R23.1 19.95,27.95 v17.6,25.6 | R12.1 23.11,43.01 v23.11,42.42 | R14.1 32.2,44.21 v30.92,42.93 30.92,42.02 v30,41.1 30,41
  Bottom 0.152: R16.1 36.86,44.73 v35.31,43.18 35.31,41.81 33.7,40.2 30.8,40.2 30,41 | v35.03,6.25 35,6.28 35,7.4 35.4,7.8 36.27,7.8 R18.1 37.67,8.43 v38.4,7.7 | v1.51,49.09 2.39,48.21 v6.82,48.21 | v9.4,43.94 9.4,43.9 10.46,42.84 v10.46,41.38 | v10.18,17.98 10.18,14.35 v12.21,12.32 12.21,11.05 v13.48,9.78 | v5.58,15.88 6.68,14.78 v8.28,14.78 8.28,13.52 | 6.86,12.1 8.28,13.52 | v4.98,8.28 4.98,8.32 1.27,12.03 1.27,39.67 v6.72,45.11 8.85,47.24 v9.73,47.24 9.93,47.24 v11.93,49.24 | HC6.4 26.7,5.05 26.7,9.61 v26.75,9.65 28.39,11.3 32.4,11.3 33.75,9.95 v34.35,9.95 | v38.45,12.35 37.07,12.35 36.45,12.97 v36.45,13.47 36.35,13.57 36.35,16.97 v36.45,17.07 | v51.83,4.82 53.38,4.82 v54.74,3.46 54.74,2.86 v54.04,2.16 | v40.56,40.04 40.56,39.14 v40.76,38.94 41.16,39.34 v41.96,39.34 | v12.38,17.98 12.38,15.98 v13.48,14.88 | v35.23,46.61 36.43,47.81 v37.93,47.81 | U2.21 47.76,36.84 v48.2,36.4 | U2.9 53.76,37.44 53.99,37.21 | 53.99,37.21 54.3,36.9 | U2.8 54.26,37.48 53.99,37.21 | U2.6 55.26,37.44 55.65,37.05 | U2.15 50.76,36.53 50.63,36.4 | C1.1 52.14,24.16 52.9,23.4 | 52.9,23.4 54.22,23.4 IC1.1 54.98,24.16 v55.54,24.16 56.14,24.76 58.74,24.76 v59.14,24.36 60.16,24.36 | IC1.23 47.5,20.2 47.2,20.5 47.2,20.9 | 47.2,20.9 47.2,21.2 | IC1.25 47.5,21.5 47.2,21.2 | IC1.24 47.25,20.85 47.2,20.9 | IC1.2 53.4,22.8 53,22.4 v52.5,22.4 | v46.3,23.9 47.2,23 47.2,21.2 | v52.5,22.4 52.5,23 52.9,23.4 | IC1.5 52.8,20.85 | 52.8,20.85 52.75,20.85 52.5,21.1 52.5,21.6 | 52.5,21.6 v52.5,22.4 | IC1.4 52.6,21.5 52.5,21.6 | IC1.3 52.75,22.15 v52.5,22.4 | IC1.14 53.3,15 52.8,15.5 52.8,20.85 | v58.89,14.5 60.48,16.09 PWM0.3 PWM1.3 63.29,16.63 v63.29,14.1 62.99,14.1 v61.29,12.4
  Bottom 0.152: 60.16,24.36 62.34,26.54 v62.34,30.46 60.74,32.06 v60.64,32.06 | v60.64,32.06 60.64,32 59.81,32 v58.5,30.69 | v60.64,32.06 56.7,35.99 56.7,37 | R22.1 40.75,13.65 41.4,13 41.4,8.53 v40.49,7.62 | v60.64,32.06 60.64,33.48 v61.65,34.49 63.69,32.46 v63.74,32.46 | v63.63,25.4 62.59,24.36 60.16,24.36 | v35.18,37.39 35.08,37.29 v27.05,37.29 27.05,38.81 v28.53,40.29 29.24,41 30,41 | v40.96,33.97 41.76,33.97 v43.16,32.56 | IC1.14 55.59,15 v56.59,16 | IC1.14 55.55,13.73 CON3.GND | CON4.10:GND 12.85,36.75 11.3,35.2 11.3,30.6 v11.5,30.4 | v11.4,25.4 v11.4,22.7 | 9.33,43.87 9.33,42.62 v6.1,39.39 | 8.28,13.52 8.4,13.4 8.4,12.1 v9.6,10.9
  pour Bottom (rank 6): -10.2,66.1 88.9,66.1 88.9,-20.7 -10.2,-20.7
  pour Top (rank 6): -10.7,66.3 89.5,66.3 89.5,-21.21 -10.7,-21.21
INT
  Top 1.27: CON4.14:INT CON4.6:INT
LED0
  Bottom 0.152: IC1.6 55,20.2 55.4,20.6 55.4,21.8 55.73,22.13 R1.2
LED1
  Bottom 0.152: R2.2 55.53,19.55 IC1.7
N$1
  Top 1.27: CON4.16:RESET CON4.8:RESET
  Bottom 0.152: R3.2 15.97,21.59 CON4.8:RESET
N$7
  Bottom 0.152: C2.1 45.61,43.48 45.61,41.29 45.26,40.94 U2.26
N$14
  Bottom 0.152: C2.2 44.76,41.92 U2.27
N$19
  Bottom 0.152: C3.1 44.26,40.8 U2.28
N$21
  Bottom 0.152: C3.2 41.98,41.08 42.67,40.39 43.43,40.39 43.76,40.06 U2.29
N$23
  Bottom 0.152: R4.2 54.13,41.38 54.36,41.15 54.86,41.15 55.76,40.25 U2.5
N$24
  Bottom 0.152: C6.2 55.83,41.2 56.26,40.77 56.26,40.76 U2.4
N$25
  Bottom 0.152: C7.2 57.62,41.62 56.76,40.76 U2.3
N$26
  Bottom 0.152: 50.06,40.64 48.44,40.64 48.26,40.46 U2.20 | R6.1 52.9,43.15 52.9,41.4 52.14,40.64 50.06,40.64 | U2.17 49.76,40.34 50.06,40.64
N$27
  Bottom 0.152: D1.ANODE 49.9,45.23 C8.2 52.16,45.59 R6.2 52.29,46.69 53.03,47.43 R5.1
PIN7  (via drill 0.35)
  Top 0.152: CON1.7 16,43.33 20.6,38.73 v20.6,26.6
  Bottom 0.152: v20.6,26.6 19.96,25.96 R3.1
PIN11
  Bottom 0.152: CON1.11 21.07,50.27 20.1,49.3 16.7,49.3 15.18,47.78 R7.1 R8.2
PIN11_H
  Bottom 0.152: R7.2 15.18,44.05 10,38.87 10,19.5 9.2,18.7 9.2,12.79 15.24,6.75 HC1.3
PIN12
  Bottom 0.152: HC1.2 15.24,14 13,14 11.3,15.7 11.3,16.4 11.4,16.5 11.4,17.9 10.6,18.7 10.6,38.59 13.01,41 14.1,41 17.09,43.99 17.09,46.79 18.42,48.12 20.65,48.12 22.35,49.82 22.35,52.49 CON1.12
PIN13
  Bottom 0.152: CON1.13 23.61,49.61 20.98,46.98 R9.1 R10.2
PIN13_H
  Bottom 0.152: HC2.3 16.5,7.63 16.5,17.5 18.6,19.6 20.4,19.6 21.7,20.9 21.7,34.8 18.3,38.2 18.3,41.9 19.7,43.3 20.3,43.3 21,44 21,44.72 R9.2
PIN15
  Bottom 0.152: CON1.15 26.36,51.02 R11.1 R12.2
PIN15_H
  Bottom 0.152: HC3.3 21.59,7.62 21.59,18.02 23.83,20.26 23.83,39.39 23.54,39.68 23.54,41.42 26.36,44.24 R11.2
PIN16
  Bottom 0.152: HC2.2 19.05,15.24 19.05,17.25 22.8,21 22.8,36.8 19.2,40.4 19.2,41.6 20.2,42.6 21.48,42.6 22.33,43.45 22.33,46.71 24.89,49.28 24.89,52.58 26.08,53.77 CON1.16
PIN18  (via drill 0.35)
  Top 0.152: v23.37,10.41 21.08,10.41 20.57,10.92 20.57,13.72 HC3.2
  Bottom 0.152: CON1.18 29.03,53.77 29.97,52.83 29.97,44.42 24.61,39.06 24.61,19.91 24.13,19.43 24.13,11.18 v23.37,10.41
PIN22
  Top 0.152: HC4.2 22.86,12.7 23.88,11.68 33.74,11.68 34.71,12.65 34.71,18.81 37.8,21.9 37.8,36.7 35.8,38.7 33.9,38.7 32,40.6 32,49.4 32.54,49.94 32.54,52.51 33.77,53.74 CON1.22
PIN29
  Bottom 0.152: CON1.29 43.93,50.61 42.09,48.77 36.01,48.77 R13.1 R14.2
PIN29_H  (via drill 0.35)
  Top 0.152: HC4.3 22.86,7.62 25.91,10.67 34.55,10.67 35.52,11.64 35.52,18.52 38.5,21.5 38.5,36.9 33.74,41.66 v33.27,41.66
  Bottom 0.152: R13.2 33.82,44.69 33.82,42.21 v33.27,41.66
PIN31
  Bottom 0.152: CON1.31 46.47,49.77 44.7,48.01 42.89,48.01 41.32,46.43 R15.1 38.6,46.43 R16.2
PIN31_H  (via drill 0.35)
  Top 0.152: HC5.3 28.1,9.05 35.47,9.05 37.39,10.98 37.39,19.39 39.2,21.2 39.2,37.1 35.62,40.68 35.62,41.21 v36.32,41.91
  Bottom 0.152: v36.32,41.91 37.51,43.1 38,43.1 38.8,43.9 R15.2
PIN32
  Bottom 0.152: CON1.32 45.96,53.77 44.69,52.5 43.13,52.5 42.67,52.05 42.67,50.55 41.66,49.53 32.51,49.53 30.79,47.8 30.79,43.98 25.37,38.56 25.37,20.33 26.6,19.1 26.6,15.17 HC5.2
PIN33
  Bottom 0.152: CON1.33 49.01,49.77 45.84,46.6 43.8,46.6 38.9,41.69 38.9,39.6 38.2,38.9 38.2,24.3 40.5,22 40.5,19.6 39.9,19 38.6,19 37.95,18.35 37.95,14.04 39.67,12.31 39.67,11.03 R17.1 R18.2
PIN33_H
  Bottom 0.152: HC6.3 27.94,6.86 29.56,8.48 35.38,8.48 36.5,9.6 36.5,10.2 37.03,10.73 R17.2
PIN35
  Bottom 0.152: CON1.35 51.55,50.53 50.55,49.53 49.74,49.53 45.94,45.74 44.47,45.74 39.72,40.98 39.72,38.91 39.2,38.4 39.2,25.1 42.21,22.09 42.21,7.11 41.25,6.15 R19.1 R20.2
PIN35_H
  Bottom 0.152: HC7.3 31.75,5.08 36.02,5.08 36.3,5.36 36.3,5.8 36.65,6.15 R19.2
PIN36  (via drill 0.35)
  Top 0.152: v29.2,19.4 28.1,20.5 25.3,20.5 24.6,21.2 24.6,37.7 26.2,39.3 v29.9,39.3
  Bottom 0.152: HC6.2 29.21,15.24 29.21,19.21 29.2,19.22 v29.2,19.4 | CON1.36 50.28,52.5 48.18,52.5 47.75,52.07 47.75,49.53 45.51,47.29 43.38,47.29 35.4,39.3 v29.9,39.3
PIN37  (via drill 0.35)
  Top 0.152: CON1.37 54.09,50.16 42.21,38.28 42.21,33.57 40.59,31.95 40.59,19.61 v41.19,19.01
  Bottom 0.152: v41.19,19.01 41.25,19.01 41.25,17.84 R22.2 R21.1
PIN37_H  (via drill 0.35)
  Top 0.152: HC8.3 34.16,7.49 36.7,7.49 39.8,10.59 v39.8,13.9
  Bottom 0.152: R21.2 39.23,14.47 v39.8,13.9
PIN38  (via drill 0.35)
  Top 0.152: CON1.38 54.09,53.19 52.83,51.93 52.83,50.04 52.07,49.28 48.01,49.28 40.65,41.92 39.62,41.92 v38.02,40.32 | v30.9,20.3 29.9,20.3 29,21.2 25.8,21.2 25.4,21.6 25.4,37.27 26.32,38.2 v30.9,38.2
  Bottom 0.152: HC7.2 31.75,15.24 31.75,19.45 v30.9,20.3 | v30.9,38.2 31.2,38.5 36.11,38.5 37.92,40.32 v38.02,40.32
PIN40  (via drill 0.35)
  Top 0.152: CON1.40 56.63,54.47 55.47,55.63 48.51,55.63 47.75,54.86 47.75,50.15 45,47.4 43.8,47.4 36.9,40.5 36.9,40.3 39.88,37.32 39.88,20.58 v39.3,20
  Bottom 0.152: HC8.2 33.45,14.4 34.8,14.4 35.5,15.1 35.5,17.5 38,20 v39.3,20
PWM0
  Bottom 0.152: R1.1 60.33,22.13 PWM0.1
PWM1
  Bottom 0.152: PWM1.1 63.02,21.71 62.01,20.7 59.7,20.7 59.61,20.61 R2.1
SCL  (via drill 0.35)
  Top 0.152: CON1.5 13.45,50.45 12.88,49.88 12.88,48.5 11.8,47.42 11.8,41.6 10.7,40.5 R24.2 | CON3.SCL 49.55,14.05 57.4,21.9 57.4,24.1 58.8,25.5 60.7,25.5 61.9,26.7 61.9,29.5 59.7,31.7 52.9,31.7 52.25,32.35 v52.25,32.85
  Bottom 0.152: CON1.5 13.45,49.52 1.78,37.85 1.78,12.95 8.9,5.83 8.9,4.9 10.9,2.9 11.7,2.9 12.82,1.78 48.68,1.78 50.04,3.13 50.04,10.48 CON3.SCL 49.55,13.85 50.1,14.4 50.1,21.6 49.55,22.15 IC1.26 | v52.25,32.85 51.7,33.4 51.7,39.02 U2.13
SDA  (via drill 0.35)
  Top 0.152: CON1.3 11.11,51.03 11.11,43.21 9.7,41.8 9.7,36.9 10.8,35.8 R26.2 | CON3.SDA 51.55,12.95 58.7,20.1 58.7,22.5 60.9,24.7 61.4,24.7 63.3,26.6 63.3,31.2 61.3,33.2 v55.1,33.2
  Bottom 0.152: CON1.3 10.91,50.93 0.76,40.78 0.76,11.44 11.18,1.02 54.7,1.02 55.79,2.11 55.79,6.31 53.2,8.9 52.2,8.9 51.55,9.55 CON3.SDA 51.95,11.37 51.95,21.35 50.4,22.9 48.52,22.9 IC1.27 | 52.26,37.38 U2.12 | U2.11 52.76,37.88 52.26,37.38 | v55.1,33.2 54.8,33.2 52.25,35.75 52.25,37.37 52.26,37.38
TR_VCC
  Top 1.27: HC8.1 HC7.1 HC6.1 HC5.1 HC4.1 HC3.1 HC2.1 HC1.1 7.5,16.5 5.97,18.03 JP1.2
UNDER
  Top 0.152: R25.1 13.6,42.85 13.6,49.1 14.7,50.2 14.7,52.48 CON1.8
UPWARD
  Top 0.152: R27.1 8.3,40.15 8.3,41.6 10.4,43.7 10.4,48.8 9.6,49.6 9.6,51.9 10.2,52.5 11.9,52.5 12.2,52.8 12.2,54.8 13,55.6 17.7,55.6 18.53,54.77 CON1.10

### Text on the board
tPlace: 1 | FaBo AI Car Board | Revision 3.2.0 | CON4 | 0 | 1 | 5V | VCC | GND | PWM | 1 | 2 | 3 | 4 | 5 | 6 | 7 | 8 | BEC | 5V | 3V3 | VCC | TRIG | 12 | 16 | 18 | 22 | 32 | 36 | 38 | 40 | SCL | SDA | 5V | GND | 11 | 13 | 15 | 29 | 31 | 33 | 35 | 37 | ECOH | GND | I2C1
bPlace: CON1 | 1 | CON2 | 1 | S/N | PCA9685 | DKFA-06 | Revision 3.2.0 | #608
Document: #608 FaBo AI Car Board_ALPHA / Rev3.2.0 2025/02/20 / DKFA-06
tDocu: OLED | DIP8
_tNames: 0.96inch OLED | heat exhaust | GY-Module BNO055 | PCA9685PW | JST PA 4PIN